# Altium schematic sheet Top.SchDoc: Top: placa de entrenamiento integradora 100 x 80 mm (ejemplo 08)
size A4; Author: Efrain Alvarado; CompanyName: Universidad de Cuenca - MCIE; DrawnBy: Efrain Alvarado; DocumentNumber: E08-T; Revision: 1.0; SheetNumber: 1; SheetTotal: 6
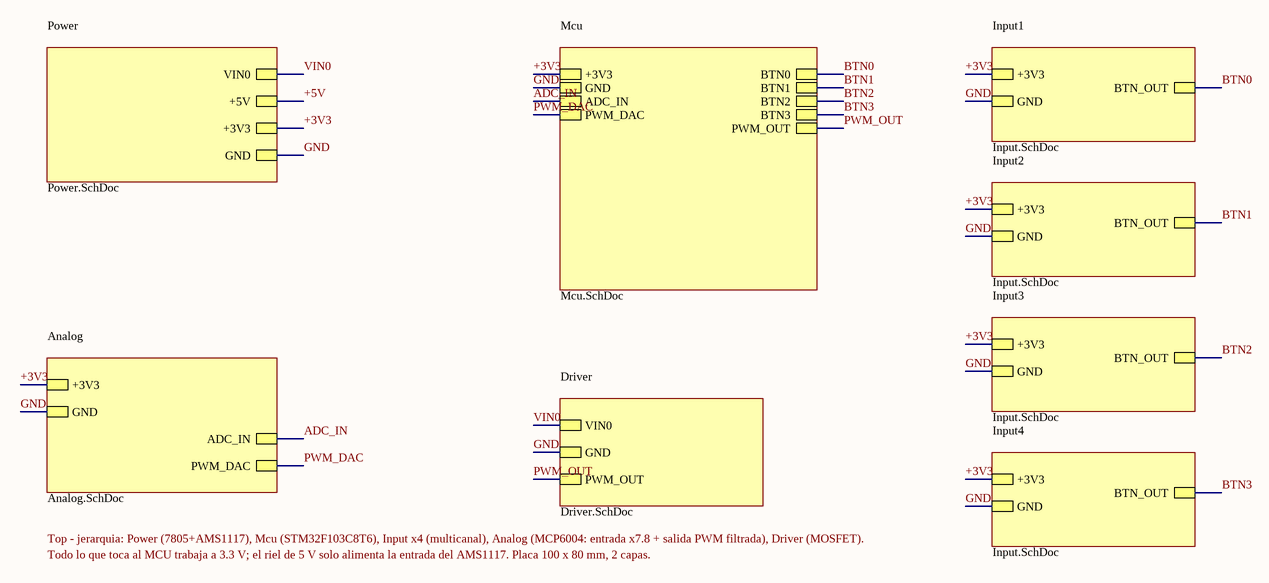
[diagram p0: Top.SchDoc]

## Sub-sheets
Analog = Analog.SchDoc: +3V3, GND, ADC_IN, PWM_DAC
Driver = Driver.SchDoc: VIN0, GND, PWM_OUT
Input1 = Input.SchDoc: +3V3, GND, BTN_OUT
Input2 = Input.SchDoc: +3V3, GND, BTN_OUT
Input3 = Input.SchDoc: +3V3, GND, BTN_OUT
Input4 = Input.SchDoc: +3V3, GND, BTN_OUT
Mcu = Mcu.SchDoc: +3V3, GND, ADC_IN, PWM_DAC, BTN0, BTN1, BTN2, BTN3, PWM_OUT
Power = Power.SchDoc: VIN0, +5V, +3V3, GND

## Nets
+3V3: sheet Power/+3V3, sheet Mcu/+3V3, sheet Input1/+3V3, sheet Input2/+3V3, sheet Input3/+3V3, sheet Input4/+3V3, sheet Analog/+3V3
+5V: sheet Power/+5V
ADC_IN: sheet Mcu/ADC_IN, sheet Analog/ADC_IN
BTN0: sheet Mcu/BTN0, sheet Input1/BTN_OUT
BTN1: sheet Mcu/BTN1, sheet Input2/BTN_OUT
BTN2: sheet Mcu/BTN2, sheet Input3/BTN_OUT
BTN3: sheet Mcu/BTN3, sheet Input4/BTN_OUT
GND: sheet Power/GND, sheet Mcu/GND, sheet Input1/GND, sheet Input2/GND, sheet Input3/GND, sheet Input4/GND, sheet Analog/GND, sheet Driver/GND
PWM_DAC: sheet Mcu/PWM_DAC, sheet Analog/PWM_DAC
PWM_OUT: sheet Mcu/PWM_OUT, sheet Driver/PWM_OUT
VIN0: sheet Power/VIN0, sheet Driver/VIN0

## Notes on the sheet
- Top - jerarquia: Power (7805+AMS1117), Mcu (STM32F103C8T6), Input x4 (multicanal), Analog (MCP6004: entrada x7.8 + salida PWM filtrada), Driver (MOSFET).
- Todo lo que toca al MCU trabaja a 3.3 V; el riel de 5 V solo alimenta la entrada del AMS1117. Placa 100 x 80 mm, 2 capas.